# Altium schematic sheet [01] Power Suppy.SchDoc: Power Supply
size A4
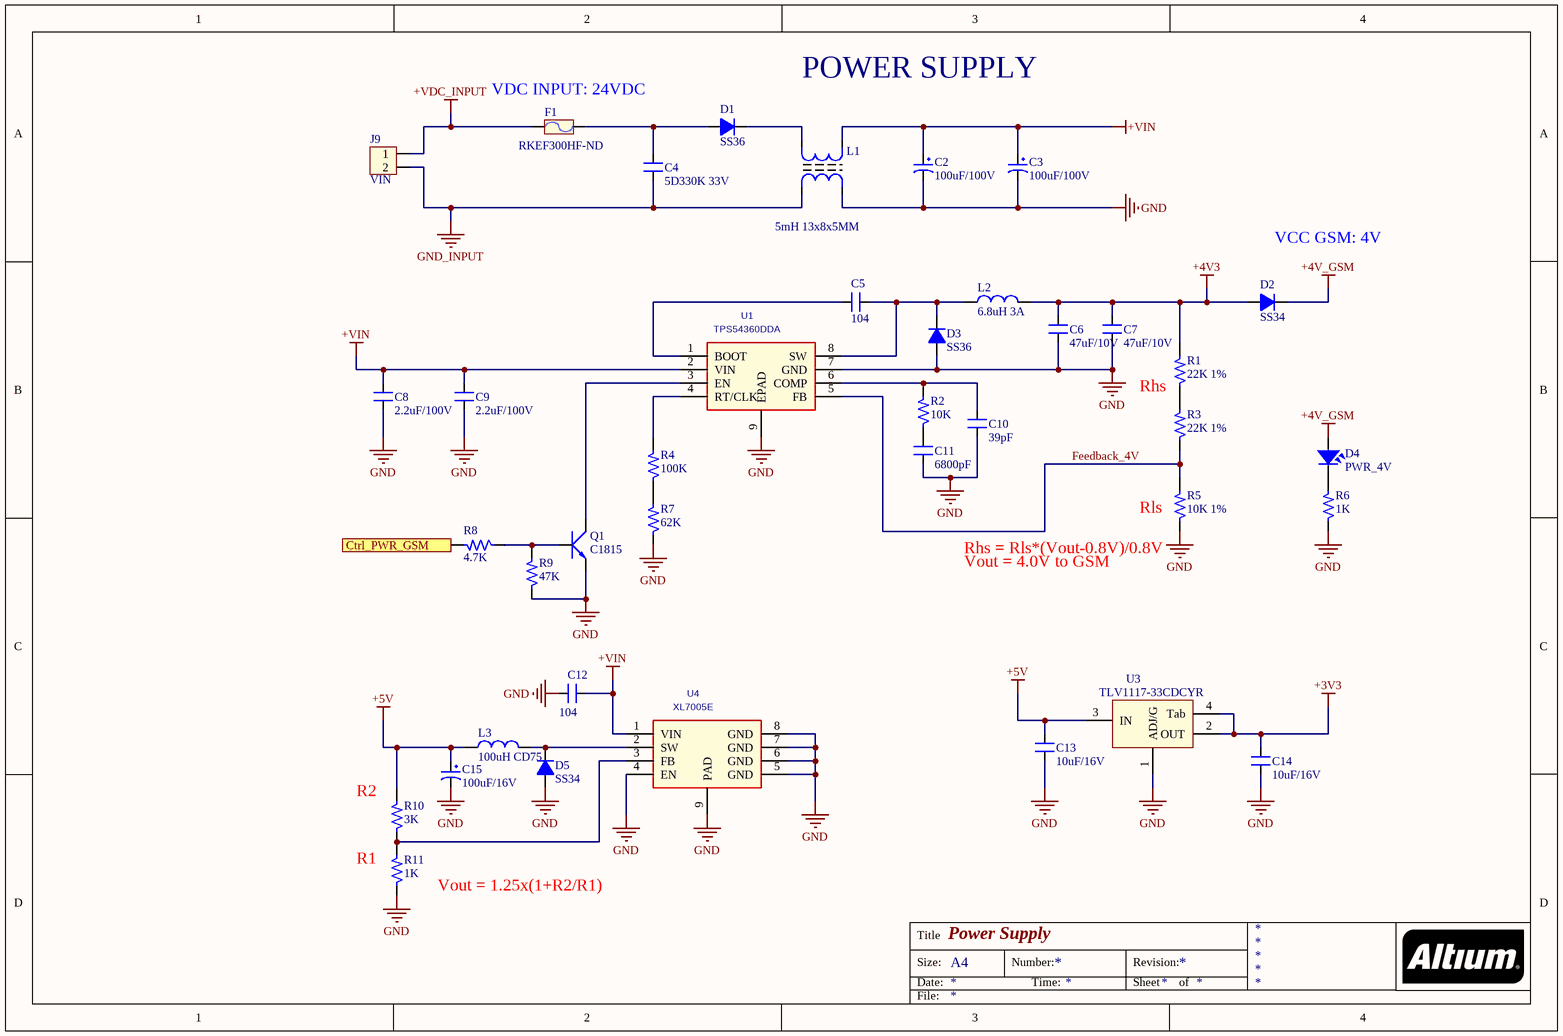
[diagram p0: [01] Power Suppy.SchDoc]

## Parts
C2  100uF/100V  [CP1.5/3.4]
C3  100uF/100V  [CP1.5/3.4]
C4  5D330K 33V  [CN2]
C5  104  [C0603 SMT]
C6  47uF/10V  [SM-1210]
C7  47uF/10V  [SM-1210]
C8  2.2uF/100V  [SM-1210]
C9  2.2uF/100V  [SM-1210]
C10  39pF  [C0603 SMT]
C11  6800pF  [C0603 SMT]
C12  104  [C0603 SMT]
C13  10uF/16V  [C0603 SMT]
C14  10uF/16V  [C0603 SMT]
C15  100uF/16V  [C_Alu_6.3x7.7]
D1  SS36  [DO-214AB SMA]
D2  SS34  [DO-214AB SMA]
D3  SS36  [DO-214AB SMA]
D4  PWR_4V  [Led_0603_Green]
D5  SS34  [DO-214AB SMA]
F1  RKEF300HF-ND  [FUSE2]
J9  VIN  [Hed2V_3.96]
L1  5mH 13x8x5MM  [L2 UF9.8]
L2  6.8uH 3A  [L01 SMD 12*12*6]
L3  100uH CD75  [L01 CD75]
Q1  C1815  [SOT23B]
R1  22K 1%  [R0603 -SMT]
R2  10K  [R0603 -SMT]
R3  22K 1%  [R0603 -SMT]
R4  100K  [R0603 -SMT]
R5  10K 1%  [R0603 -SMT]
R6  1K  [R0603 -SMT]
R7  62K  [R0603 -SMT]
R8  4.7K  [R0603 -SMT]
R9  47K  [R0603 -SMT]
R10  3K  [R0603 -SMT]
R11  1K  [R0603 -SMT]
U1  TPS54360DDA  [DDA8_3P1X2P4-M]
U3  TLV1117-33CDCYR  [SOT223-4N]
U4  XL7005E  [DDA8_3P1X2P4-M]

## Ports
Ctrl_PWR_GSM

## Nets
+3V3: C14.2 U3.2(OUT) U3.4(Tab)
+4V3: C6.2 C7.2 D2.1(A) L2.2 R1.2
+4V_GSM: D2.2(K) D4.1
+5V: C13.2 C15.1 L3.1 R10.2 U3.3(IN)
+VDC_INPUT: F1.1 J9.1
+VIN: C2.1 C3.1 C8.2 C9.2 C12.2 L1.3 U1.2(VIN) U4.1(VIN)
GND: C2.2 C3.2 C6.1 C7.1 C8.1 C9.1 C10.1 C11.1 C12.1 C13.1 C14.1 C15.2 D3.1(A) D5.1(A) L1.2 Q1.1(E) R5.1 R6.1 R7.1 R9.1 R11.1 U1.7(GND) U1.9(EPAD) U3.1(ADJ/G) U4.4(EN) U4.5(GND) U4.6(GND) U4.7(GND) U4.8(GND) U4.9(PAD)
GND_INPUT: C4.1 J9.2 L1.1
Ctrl_PWR_GSM: R8.2 ; port Ctrl_PWR_GSM
Feedback_4V: R3.1 R5.2 U1.5(FB)
NetC4_2: C4.2 D1.1(A) F1.2
NetC5_1: C5.1 U1.1(BOOT)
NetC5_2: C5.2 D3.2(K) L2.1 U1.8(SW)
NetC10_2: C10.2 R2.2 U1.6(COMP)
NetC11_2: C11.2 R2.1
NetD1_2: D1.2(K) L1.4
NetD4_2: D4.2 R6.2
NetD5_2: D5.2(K) L3.2 U4.2(SW)
NetQ1_2: Q1.2(C) U1.3(EN)
NetQ1_3: Q1.3(B) R8.1 R9.2
NetR1_1: R1.1 R3.2
NetR4_1: R4.1 R7.2
NetR4_2: R4.2 U1.4(RT/CLK)
NetR10_1: R10.1 R11.2 U4.3(FB)

## Notes on the sheet
- (near F1) VDC INPUT: 24VDC
- POWER SUPPLY
- VCC GSM: 4V
- Rhs
- (near R5) Rls
- (near R5) Rhs = Rls*(Vout-0.8V)/0.8V
- Vout = 4.0V to GSM
- (near R10) R2
- R1
- Vout = 1.25x(1+R2/R1)
- Title
- Size:
- Date:
- A4
- Number:
- Time:
- Revision:
- Sheet
- of
- File:

## Library data of the parts
C2 C3 = CP4: Cap 1000uF/16V - 220uF/50V; Description 5: 4,7uF>10uF/250V_3,3uF>10uF/400V - 2,2uF>4,7uF/450V; Description 1: 2200uF-3300uF/6,3V - 1000uF-2200uF/10V; Description 2: 1000uF/16V - 470uF => 1000uF/25V - 100uF/100V; Description 3: 330uF>470uF/35V_220uF>470uF/50V_10uF>22uF/250V; Description 4: 220uF => 330uF/63V - 10uF =>33uF/160 - 200V; Value: 1000uF/16V
C4 = CN: Value: 0,1uF/300V; Designed by: VanDungEvn
C5 C10-C14 = CM: Cap SMD; Value: 103
C6 = CM: CAP CER 47UF 10V X5R 1210; Value: 103
C7 = CM: CAP CER 47UF 10V X5R 1210 1276-3380-2-ND; Value: 103
C8 C9 = CM: CAP CER 2.2UF 100V X7R 1210  445-4498-2-ND; Value: 103
C15 = C-Alu-Tantalum: Cap Aluminum, Tantalum 7343; Value: 10uF/50V; Description 1: 10 => 220uF/6,3V/10V - 10uF => 100uF/16V; Description 2: 0,1uF => 33uF/50V - 10uF => 22uF/63V; Description 3: 0,47uF => 10uF/100V
D1 D3 = D5A: DIODE SCHOTTKY 60V 3A SMA; Value: 1N5408
D2 D5 = D1A: DIODE SCHOTTKY 40V 3A SMC; Value: 1N4007
D4 = LED: LED 0603 RED; Value: LED 3 ly Single Colour
F1 = Fuse: PTC RESET FUSE 60V 3A RADIAL; Designed by: VanDungEvn; Value: Fuse
J9 = Hed2: Header 2 (Green); Value: Header 2
L1 = L2x220: Value: Loc 220; Designed by: VanDungEvn
L2 = L1: 6.8uH 3A 12x12x7MM; Value: 150 mH
L3 = L1: Value: 150 mH
Q1 = C1815: NPN 600mW, ECB; Value: C1815
R1-R5 R7-R10 = RM: Resistor SMD; Value: 1K
R6 R11 = RM: Resistor SMD; Value: 1K
U1 = TPS54360DDA: REG BUCK SPLIT RAIL 8SOPWRPAD; C: Copyright (C) 2015 Accelerated Designs. All rights reserved; Vendor: TEXAS INSTRUMENTS; Built_By: EMA_UL_Team; Value: TPS54360DDA; Manufacturer_Part_Number: TPS54360DDA
U3 = LM1117: 3v3; Value: LM317
U4 = XL7005: REG BUCK SPLIT RAIL 8SOPWRPAD; Value: TPS54360DDA; C: Copyright (C) 2015 Accelerated Designs. All rights reserved; Vendor: TEXAS INSTRUMENTS; Built_By: EMA_UL_Team; Manufacturer_Part_Number: TPS54360DDA